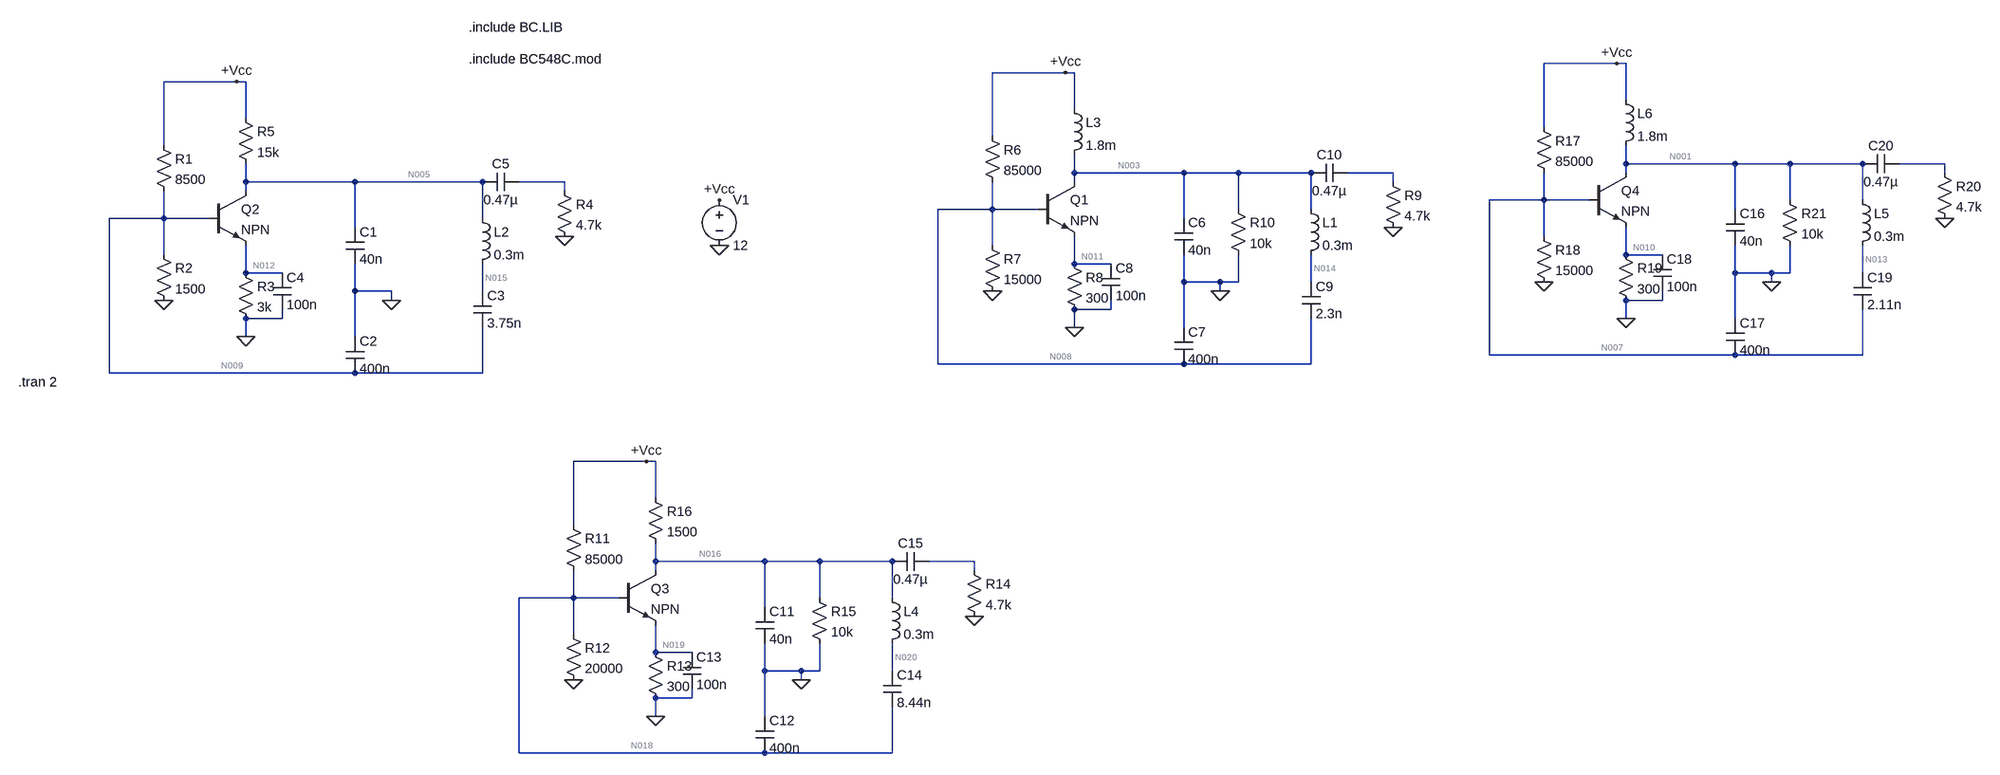
[diagram p0: schematic Draft1.asc]
Draft1.asc, the LTspice schematic file:
Version 4
SHEET 1 3464 1256
WIRE 2592 -48 2464 -48
WIRE 2608 -48 2592 -48
WIRE 1568 -32 1440 -32
WIRE 1584 -32 1568 -32
WIRE 112 -16 -16 -16
WIRE 128 -16 112 -16
WIRE 2608 16 2608 -48
WIRE 1584 32 1584 -32
WIRE 128 48 128 -16
WIRE 2464 64 2464 -48
WIRE 1440 80 1440 -32
WIRE -16 96 -16 -16
WIRE 2608 128 2608 96
WIRE 2800 128 2608 128
WIRE 2896 128 2800 128
WIRE 3024 128 2896 128
WIRE 3168 128 3088 128
WIRE 1584 144 1584 112
WIRE 1776 144 1584 144
WIRE 1872 144 1776 144
WIRE 2000 144 1872 144
WIRE 2144 144 2064 144
WIRE 2608 144 2608 128
WIRE 3168 144 3168 128
WIRE 128 160 128 128
WIRE 320 160 128 160
WIRE 544 160 320 160
WIRE 688 160 608 160
WIRE 1584 160 1584 144
WIRE 2144 160 2144 144
WIRE 128 176 128 160
WIRE 688 176 688 160
WIRE 2464 192 2464 144
WIRE 2464 192 2368 192
WIRE 2544 192 2464 192
WIRE 2896 192 2896 128
WIRE 3024 192 3024 128
WIRE 1440 208 1440 160
WIRE 1440 208 1344 208
WIRE 1520 208 1440 208
WIRE 1872 208 1872 144
WIRE 2000 208 2000 144
WIRE 2800 208 2800 128
WIRE -16 224 -16 176
WIRE -16 224 -112 224
WIRE 64 224 -16 224
WIRE 544 224 544 160
WIRE 1776 224 1776 144
WIRE 320 240 320 160
WIRE 2464 256 2464 192
WIRE 1440 272 1440 208
WIRE -16 288 -16 224
WIRE 2608 288 2608 240
WIRE 2672 288 2608 288
WIRE 1584 304 1584 256
WIRE 1648 304 1584 304
WIRE 128 320 128 272
WIRE 192 320 128 320
WIRE 2800 320 2800 272
WIRE 2864 320 2800 320
WIRE 2896 320 2896 272
WIRE 2896 320 2864 320
WIRE 3024 320 3024 272
WIRE 1776 336 1776 288
WIRE 1840 336 1776 336
WIRE 1872 336 1872 288
WIRE 1872 336 1840 336
WIRE 2000 336 2000 288
WIRE 2864 336 2864 320
WIRE 320 352 320 304
WIRE 384 352 320 352
WIRE 544 352 544 304
WIRE 1840 352 1840 336
WIRE 384 368 384 352
WIRE 2672 368 2672 352
WIRE 2672 368 2608 368
WIRE 1648 384 1648 368
WIRE 1648 384 1584 384
WIRE 192 400 192 384
WIRE 192 400 128 400
WIRE 2608 400 2608 368
WIRE 2800 400 2800 320
WIRE 1584 416 1584 384
WIRE 1776 416 1776 336
WIRE 128 432 128 400
WIRE 320 432 320 352
WIRE 2368 464 2368 192
WIRE 2800 464 2368 464
WIRE 3024 464 3024 384
WIRE 3024 464 2800 464
WIRE 1344 480 1344 208
WIRE 1776 480 1344 480
WIRE 2000 480 2000 400
WIRE 2000 480 1776 480
WIRE -112 496 -112 224
WIRE 320 496 -112 496
WIRE 544 496 544 416
WIRE 544 496 320 496
WIRE 832 736 704 736
WIRE 848 736 832 736
WIRE 848 800 848 736
WIRE 704 848 704 736
WIRE 848 912 848 880
WIRE 1040 912 848 912
WIRE 1136 912 1040 912
WIRE 1264 912 1136 912
WIRE 1408 912 1328 912
WIRE 848 928 848 912
WIRE 1408 928 1408 912
WIRE 704 976 704 928
WIRE 704 976 608 976
WIRE 784 976 704 976
WIRE 1136 976 1136 912
WIRE 1264 976 1264 912
WIRE 1040 992 1040 912
WIRE 704 1040 704 976
WIRE 848 1072 848 1024
WIRE 912 1072 848 1072
WIRE 1040 1104 1040 1056
WIRE 1104 1104 1040 1104
WIRE 1136 1104 1136 1056
WIRE 1136 1104 1104 1104
WIRE 1264 1104 1264 1056
WIRE 1104 1120 1104 1104
WIRE 912 1152 912 1136
WIRE 912 1152 848 1152
WIRE 848 1184 848 1152
WIRE 1040 1184 1040 1104
WIRE 608 1248 608 976
WIRE 1040 1248 608 1248
WIRE 1264 1248 1264 1168
WIRE 1264 1248 1040 1248
FLAG 960 192 +Vcc
FLAG 960 272 0
FLAG 384 368 0
FLAG 128 432 0
FLAG -16 368 0
FLAG 688 256 0
FLAG 112 -16 +Vcc
FLAG 1840 352 0
FLAG 1584 416 0
FLAG 1440 352 0
FLAG 2144 240 0
FLAG 1568 -32 +Vcc
FLAG 1104 1120 0
FLAG 848 1184 0
FLAG 704 1120 0
FLAG 1408 1008 0
FLAG 832 736 +Vcc
FLAG 2864 336 0
FLAG 2608 400 0
FLAG 2464 336 0
FLAG 3168 224 0
FLAG 2592 -48 +Vcc
SYMBOL cap 304 240 R0
SYMATTR InstName C1
SYMATTR Value 40n
SYMBOL res -32 80 R0
SYMATTR InstName R1
SYMATTR Value 8500
SYMBOL res -32 272 R0
SYMATTR InstName R2
SYMATTR Value 1500
SYMBOL cap 304 432 R0
SYMATTR InstName C2
SYMATTR Value 400n
SYMBOL voltage 960 176 R0
WINDOW 123 0 0 Left 0
WINDOW 39 0 0 Left 0
SYMATTR InstName V1
SYMATTR Value 12
SYMBOL res 112 304 R0
SYMATTR InstName R3
SYMATTR Value 3k
SYMBOL cap 176 320 R0
SYMATTR InstName C4
SYMATTR Value 100n
SYMBOL cap 528 352 R0
SYMATTR InstName C3
SYMATTR Value 3.75n
SYMBOL ind 528 208 R0
SYMATTR InstName L2
SYMATTR Value 0.3m
SYMATTR SpiceLine Rser=1
SYMBOL cap 608 144 R90
WINDOW 0 0 32 VBottom 2
WINDOW 3 32 32 VTop 2
SYMATTR InstName C5
SYMATTR Value 0.47µ
SYMBOL res 672 160 R0
SYMATTR InstName R4
SYMATTR Value 4.7k
SYMBOL npn 64 176 R0
SYMATTR InstName Q2
SYMBOL res 112 32 R0
SYMATTR InstName R5
SYMATTR Value 15k
SYMBOL cap 1760 224 R0
SYMATTR InstName C6
SYMATTR Value 40n
SYMBOL res 1424 64 R0
SYMATTR InstName R6
SYMATTR Value 85000
SYMBOL res 1424 256 R0
SYMATTR InstName R7
SYMATTR Value 15000
SYMBOL cap 1760 416 R0
SYMATTR InstName C7
SYMATTR Value 400n
SYMBOL res 1568 288 R0
SYMATTR InstName R8
SYMATTR Value 300
SYMBOL cap 1632 304 R0
SYMATTR InstName C8
SYMATTR Value 100n
SYMBOL cap 1984 336 R0
SYMATTR InstName C9
SYMATTR Value 2.3n
SYMBOL ind 1984 192 R0
SYMATTR InstName L1
SYMATTR Value 0.3m
SYMATTR SpiceLine Rser=5.5
SYMBOL cap 2064 128 R90
WINDOW 0 0 32 VBottom 2
WINDOW 3 32 32 VTop 2
SYMATTR InstName C10
SYMATTR Value 0.47µ
SYMBOL res 2128 144 R0
SYMATTR InstName R9
SYMATTR Value 4.7k
SYMBOL ind 1568 16 R0
SYMATTR InstName L3
SYMATTR Value 1.8m
SYMBOL res 1856 192 R0
SYMATTR InstName R10
SYMATTR Value 10k
SYMBOL cap 1024 992 R0
SYMATTR InstName C11
SYMATTR Value 40n
SYMBOL res 688 832 R0
SYMATTR InstName R11
SYMATTR Value 85000
SYMBOL res 688 1024 R0
SYMATTR InstName R12
SYMATTR Value 20000
SYMBOL cap 1024 1184 R0
SYMATTR InstName C12
SYMATTR Value 400n
SYMBOL res 832 1056 R0
SYMATTR InstName R13
SYMATTR Value 300
SYMBOL cap 896 1072 R0
SYMATTR InstName C13
SYMATTR Value 100n
SYMBOL cap 1248 1104 R0
SYMATTR InstName C14
SYMATTR Value 8.44n
SYMBOL ind 1248 960 R0
SYMATTR InstName L4
SYMATTR Value 0.3m
SYMATTR SpiceLine Rser=5.5
SYMBOL cap 1328 896 R90
WINDOW 0 0 32 VBottom 2
WINDOW 3 32 32 VTop 2
SYMATTR InstName C15
SYMATTR Value 0.47µ
SYMBOL res 1392 912 R0
SYMATTR InstName R14
SYMATTR Value 4.7k
SYMBOL npn 784 928 R0
SYMATTR InstName Q3
SYMBOL res 832 784 R0
SYMATTR InstName R16
SYMATTR Value 1500
SYMBOL res 1120 960 R0
SYMATTR InstName R15
SYMATTR Value 10k
SYMBOL cap 2784 208 R0
SYMATTR InstName C16
SYMATTR Value 40n
SYMBOL res 2448 48 R0
SYMATTR InstName R17
SYMATTR Value 85000
SYMBOL res 2448 240 R0
SYMATTR InstName R18
SYMATTR Value 15000
SYMBOL cap 2784 400 R0
SYMATTR InstName C17
SYMATTR Value 400n
SYMBOL res 2592 272 R0
SYMATTR InstName R19
SYMATTR Value 300
SYMBOL cap 2656 288 R0
SYMATTR InstName C18
SYMATTR Value 100n
SYMBOL cap 3008 320 R0
SYMATTR InstName C19
SYMATTR Value 2.11n
SYMBOL ind 3008 176 R0
SYMATTR InstName L5
SYMATTR Value 0.3m
SYMATTR SpiceLine Rser=1
SYMBOL cap 3088 112 R90
WINDOW 0 0 32 VBottom 2
WINDOW 3 32 32 VTop 2
SYMATTR InstName C20
SYMATTR Value 0.47µ
SYMBOL res 3152 128 R0
SYMATTR InstName R20
SYMATTR Value 4.7k
SYMBOL npn 2544 144 R0
SYMATTR InstName Q4
SYMBOL ind 2592 0 R0
SYMATTR InstName L6
SYMATTR Value 1.8m
SYMBOL res 2880 176 R0
SYMATTR InstName R21
SYMATTR Value 10k
SYMBOL npn 1520 160 R0
SYMATTR InstName Q1
TEXT 520 -56 Left 2 !.include BC548C.mod
TEXT -272 512 Left 2 !.tran 2
TEXT 520 -112 Left 2 !.include BC.LIB

The netlist it stands for:
* Draft1.asc
C1 N005 0 40n
R1 +Vcc N009 8500
R2 N009 0 1500
C2 0 N009 400n
V1 +Vcc 0 12
R3 N012 0 3k
C4 N012 0 100n
C3 N015 N009 3.75n
L2 N005 N015 0.3m Rser=1
C5 N006 N005 0.47µ
R4 N006 0 4.7k
Q2 N005 N009 N012 0 NPN
R5 +Vcc N005 15k
C6 N003 0 40n
R6 +Vcc N008 85000
R7 N008 0 15000
C7 0 N008 400n
R8 N011 0 300
C8 N011 0 100n
C9 N014 N008 2.3n
L1 N003 N014 0.3m Rser=5.5
C10 N004 N003 0.47µ
R9 N004 0 4.7k
L3 +Vcc N003 1.8m
R10 N003 0 10k
C11 N016 0 40n
R11 +Vcc N018 85000
R12 N018 0 20000
C12 0 N018 400n
R13 N019 0 300
C13 N019 0 100n
C14 N020 N018 8.44n
L4 N016 N020 0.3m Rser=5.5
C15 N017 N016 0.47µ
R14 N017 0 4.7k
Q3 N016 N018 N019 0 NPN
R16 +Vcc N016 1500
R15 N016 0 10k
C16 N001 0 40n
R17 +Vcc N007 85000
R18 N007 0 15000
C17 0 N007 400n
R19 N010 0 300
C18 N010 0 100n
C19 N013 N007 2.11n
L5 N001 N013 0.3m Rser=1
C20 N002 N001 0.47µ
R20 N002 0 4.7k
Q4 N001 N007 N010 0 NPN
L6 +Vcc N001 1.8m
R21 N001 0 10k
Q1 N003 N008 N011 0 NPN
.model NPN NPN
.model PNP PNP
.lib standard.bjt
.include BC548C.mod
.tran 2
.include BC.LIB
.backanno
.end

* Results of the author's LTspice run, read from the files saved beside the schematic
* Operating Point, zero values left out:
*   V(n005) = 6.808 V
*   V(+vcc) = 12 V
*   V(n009) = 1.796 V
*   V(n012) = 1.049 V
*   V(n015) = 6.808 V
*   V(n003) = 12 V
*   V(n008) = 1.503 V
*   V(n011) = 706.6 mV
*   V(n014) = 12 V
*   V(n016) = 6.278 V
*   V(n018) = 1.77 V
*   V(n019) = 965.6 mV
*   V(n020) = 6.278 V
*   V(n001) = 12 V
*   V(n007) = 1.503 V
*   V(n010) = 706.6 mV
*   V(n013) = 12 V
*   Ic(Q2) = 346.1 µA
*   Ib(Q2) = 3.461 µA
*   Ie(Q2) = -349.6 µA
*   Ic(Q3) = 3.187 mA
*   Ib(Q3) = 31.87 µA
*   Ie(Q3) = -3.219 mA
*   Ic(Q4) = 2.332 mA
*   Ib(Q4) = 23.32 µA
*   Ie(Q4) = -2.355 mA
*   Ic(Q1) = 2.332 mA
*   Ib(Q1) = 23.32 µA
*   Ie(Q1) = -2.355 mA
*   I(L3) = 3.532 mA
*   I(L6) = 3.532 mA
*   I(R1) = 1.201 mA
*   I(R2) = 1.197 mA
*   I(R3) = 349.6 µA
*   I(R5) = 346.1 µA
*   I(R6) = 123.5 µA
*   I(R7) = 100.2 µA
*   I(R8) = 2.355 mA
*   I(R10) = 1.2 mA
*   I(R11) = 120.4 µA
*   I(R12) = 88.49 µA
*   I(R13) = 3.219 mA
*   I(R16) = 3.815 mA
*   I(R15) = 627.8 µA
*   I(R17) = 123.5 µA
*   I(R18) = 100.2 µA
*   I(R19) = 2.355 mA
*   I(R21) = 1.2 mA
*   I(V1) = -12.79 mA